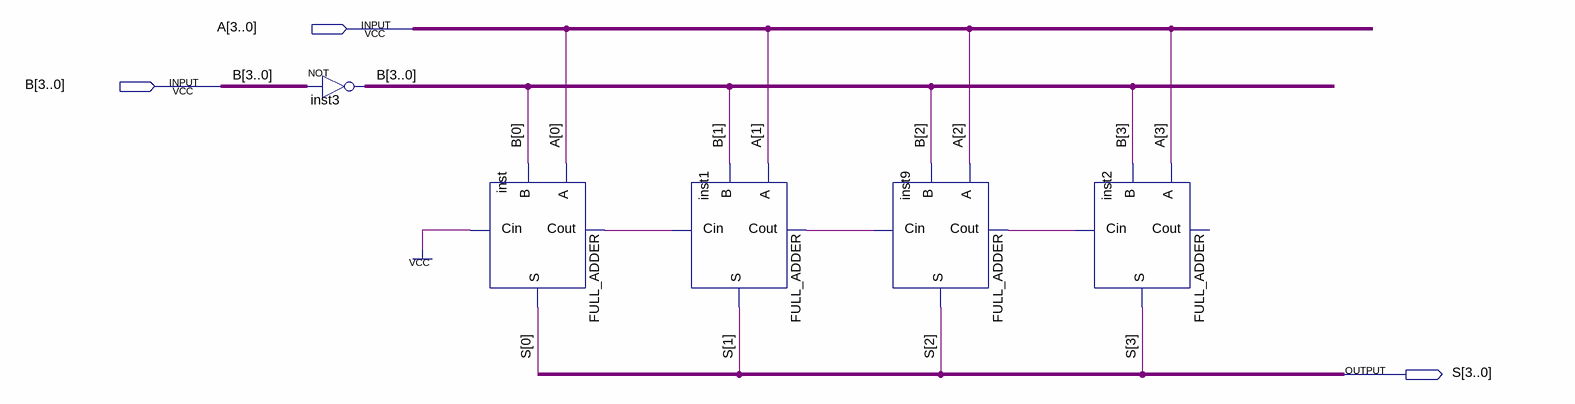
[diagram p0: schematic sheet]
// Quartus schematic Sub4bit.bdf as structural Verilog: 5 symbols, 3 pins
module Sub4bit (
  input  [3:0] A,
  input  [3:0] B,
  output [3:0] S
);

  wire inst1_cout, inst9_cout, inst_cout;

  assign B = ~B;  // NOT inst3, 4 bits wide
  FULL_ADDER inst (.A(A[0]), .B(B[0]), .Cin(1'b1), .S(S[0]), .Cout(inst_cout));
  FULL_ADDER inst1 (.A(A[1]), .B(B[1]), .Cin(inst_cout), .S(S[1]), .Cout(inst1_cout));
  FULL_ADDER inst9 (.A(A[2]), .B(B[2]), .Cin(inst1_cout), .S(S[2]), .Cout(inst9_cout));
  FULL_ADDER inst2 (.A(A[3]), .B(B[3]), .Cin(inst9_cout), .S(S[3]));  // open: Cout
endmodule
